# Altium schematic sheet BMS.SchDoc
size A4
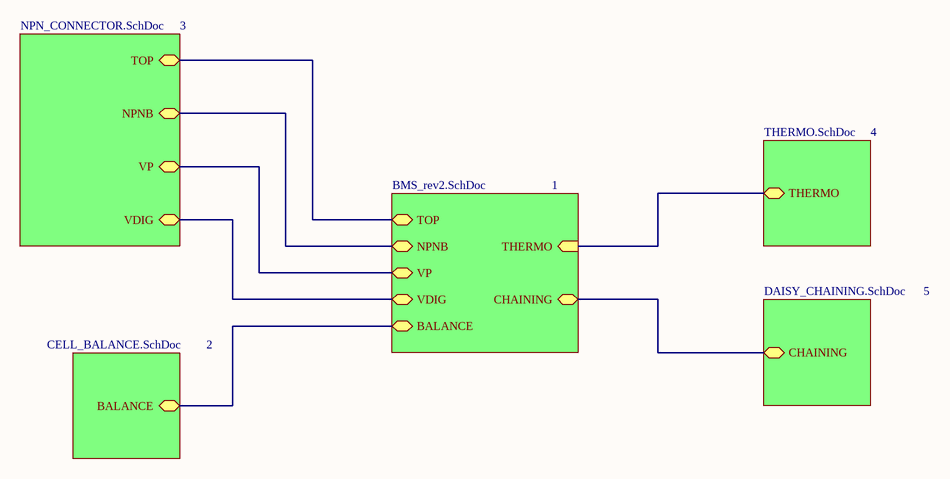
[diagram p0: BMS.SchDoc]

## Sub-sheets
1 = BMS_rev2.SchDoc: TOP, NPNB, VP, BALANCE, THERMO (in), CHAINING, VDIG
2 = CELL_BALANCE.SchDoc: BALANCE
3 = NPN_CONNECTOR.SchDoc: TOP, NPNB, VP, VDIG
4 = THERMO.SchDoc: THERMO (harness thermo)
5 = DAISY_CHAINING.SchDoc: CHAINING

## Nets
(unnamed): sheet 1/TOP, sheet 3/TOP
(unnamed): sheet 1/NPNB, sheet 3/NPNB
(unnamed): sheet 1/VP, sheet 3/VP
(unnamed): sheet 1/BALANCE, sheet 2/BALANCE
(unnamed): sheet 1/CHAINING, sheet 5/CHAINING
(unnamed): sheet 1/VDIG, sheet 3/VDIG